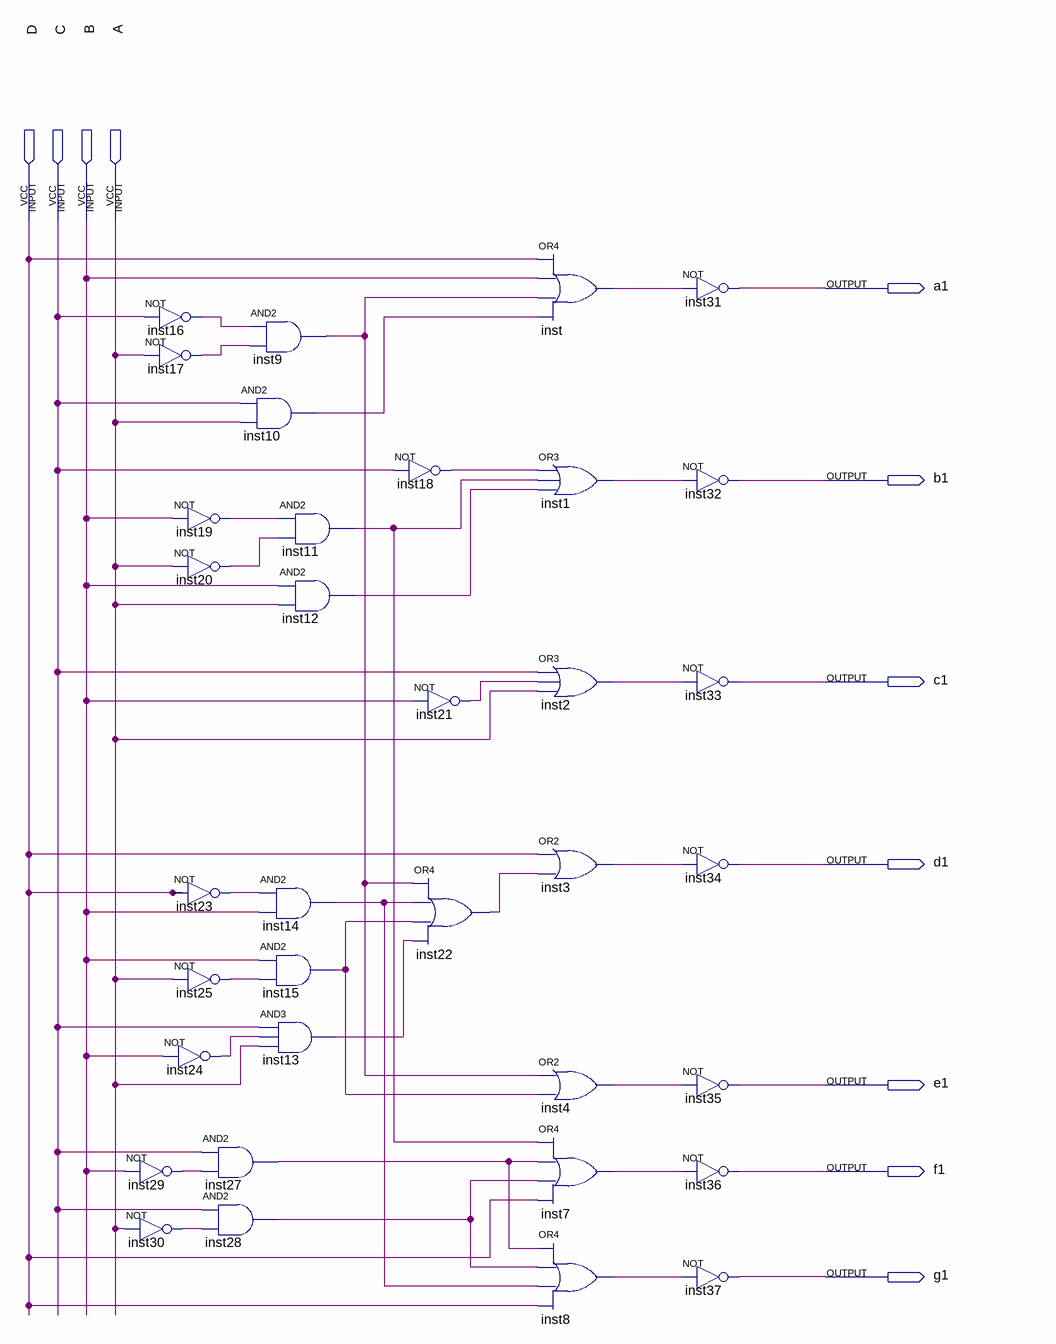
[diagram p0: schematic sheet]
// Quartus schematic circuito_display.bdf as structural Verilog: 35 symbols, 11 pins
module circuito_display (
  input  D,
  input  C,
  input  B,
  input  A,
  output a1,
  output b1,
  output c1,
  output d1,
  output e1,
  output f1,
  output g1
);

  wire inst1_out, inst2_out, inst3_out, inst4_out, inst7_out, inst8_out, inst9_out, inst10_out, inst11_out,
       inst12_out, inst13_out, inst14_out, inst15_out, inst16_out, inst17_out, inst18_out, inst19_out,
       inst20_out, inst21_out, inst22_out, inst23_out, inst24_out, inst25_out, inst27_out, inst28_out,
       inst29_out, inst30_out, inst_out;

  not inst16 (inst16_out, C);
  not inst17 (inst17_out, A);
  not inst24 (inst24_out, B);
  not inst29 (inst29_out, B);
  not inst30 (inst30_out, A);
  and inst10 (inst10_out, C, A);
  not inst19 (inst19_out, B);
  not inst20 (inst20_out, A);
  not inst23 (inst23_out, D);
  not inst25 (inst25_out, A);
  and inst27 (inst27_out, C, inst29_out);
  and inst28 (inst28_out, C, inst30_out);
  and inst9 (inst9_out, inst16_out, inst17_out);
  and inst11 (inst11_out, inst19_out, inst20_out);
  and inst12 (inst12_out, B, A);
  and inst14 (inst14_out, inst23_out, B);
  and inst15 (inst15_out, B, inst25_out);
  and inst13 (inst13_out, C, inst24_out, A);
  not inst18 (inst18_out, C);
  not inst21 (inst21_out, B);
  or inst22 (inst22_out, inst9_out, inst14_out, inst15_out, inst13_out);
  or inst (inst_out, D, B, inst9_out, inst10_out);
  or inst1 (inst1_out, inst18_out, inst11_out, inst12_out);
  or inst2 (inst2_out, C, inst21_out, A);
  or inst3 (inst3_out, D, inst22_out);
  or inst4 (inst4_out, inst9_out, inst15_out);
  or inst7 (inst7_out, inst11_out, inst27_out, inst28_out, D);
  or inst8 (inst8_out, inst27_out, inst28_out, inst14_out, D);
  not inst31 (a1, inst_out);
  not inst32 (b1, inst1_out);
  not inst33 (c1, inst2_out);
  not inst34 (d1, inst3_out);
  not inst35 (e1, inst4_out);
  not inst36 (f1, inst7_out);
  not inst37 (g1, inst8_out);
endmodule
